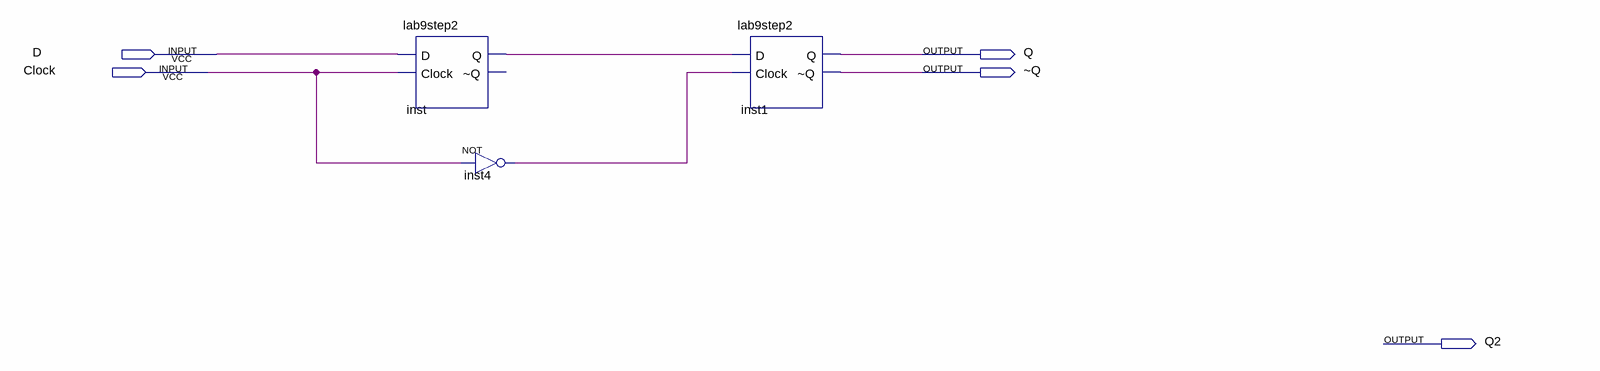
[diagram p0: schematic sheet]
// Quartus schematic lab9step3a.bdf as structural Verilog: 3 symbols, 5 pins
module lab9step3a (
  input  D,
  input  Clock,
  output Q,
  output \~Q ,
  output Q2
);

  wire inst4_out, inst_q;

  lab9step2 inst (.D(D), .Clock(Clock), .Q(inst_q));  // open: ~Q
  not inst4 (inst4_out, Clock);
  lab9step2 inst1 (.D(inst_q), .Clock(inst4_out), .Q(Q), .\~Q (\~Q ));
endmodule
